# Altium schematic sheet LED_Logic.SchDoc
size A
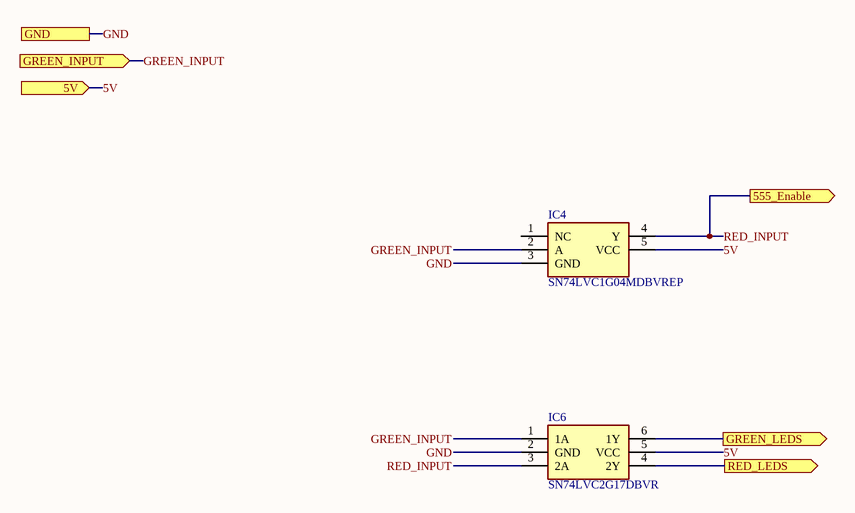
[diagram p0: LED_Logic.SchDoc]

## Parts
IC4  SN74LVC1G04MDBVREP  [SOT95P280X145-5N]
IC6  SN74LVC2G17DBVR  [SOT95P280X145-6N]

## Ports
5V (in), 555_Enable (out), GND, GREEN_INPUT (in), GREEN_LEDS (out), RED_LEDS (out)

## Nets
5V: IC4.5(VCC) IC6.5(VCC) ; port 5V
GND: IC4.3(GND) IC6.2(GND) ; port GND
GREEN_INPUT: IC4.2(A) IC6.1(1A) ; port GREEN_INPUT
GREEN_LEDS: IC6.6(1Y) ; port GREEN_LEDS
RED_INPUT: IC4.4(Y) IC6.3(2A) ; port 555_Enable
RED_LEDS: IC6.4(2Y) ; port RED_LEDS

Not connected (* = marked no-connect by the designer): IC4 1(NC)

## Library data of the parts
IC4 = SN74LVC1G04MDBVREP: Integrated Circuit; Manufacturer_Name: Texas Instruments; Datasheet Link: http://www.ti.com/lit/gpn/sn74lvc1g04-ep; Height: 1.45mm; Manufacturer_Part_Number: SN74LVC1G04MDBVREP; Mouser Part Number: 595-SN74LVC04MDBVREP; Mouser Price/Stock: https://www.mouser.co.uk/ProductDetail/Texas-Instruments/SN74LVC1G04MDBVREP?qs=l4wu3mKjyflWQOlEvZuvmw%3D%3D; Arrow Part Number: SN74LVC1G04MDBVREP; Arrow Price/Stock: https://www.arrow.com/en/products/sn74lvc1g04mdbvrep/texas-instruments?utm_currency=USD&region=nac
IC6 = SN74LVC2G17DBVR: Integrated Circuit; Manufacturer_Name: Texas Instruments; Datasheet Link: http://www.ti.com/lit/gpn/sn74lvc2g17; Height: 1.45mm; Manufacturer_Part_Number: SN74LVC2G17DBVR; Mouser Part Number: 595-SN74LVC2G17DBVR; Mouser Price/Stock: https://www.mouser.co.uk/ProductDetail/Texas-Instruments/SN74LVC2G17DBVR?qs=X1HXWTtiZ0RnstCufGEJxQ%3D%3D; Arrow Part Number: SN74LVC2G17DBVR; Arrow Price/Stock: https://www.arrow.com/en/products/sn74lvc2g17dbvr/texas-instruments?utm_currency=USD&region=nac